# Altium project Custom Arduino Nano Control board.PrjPcb
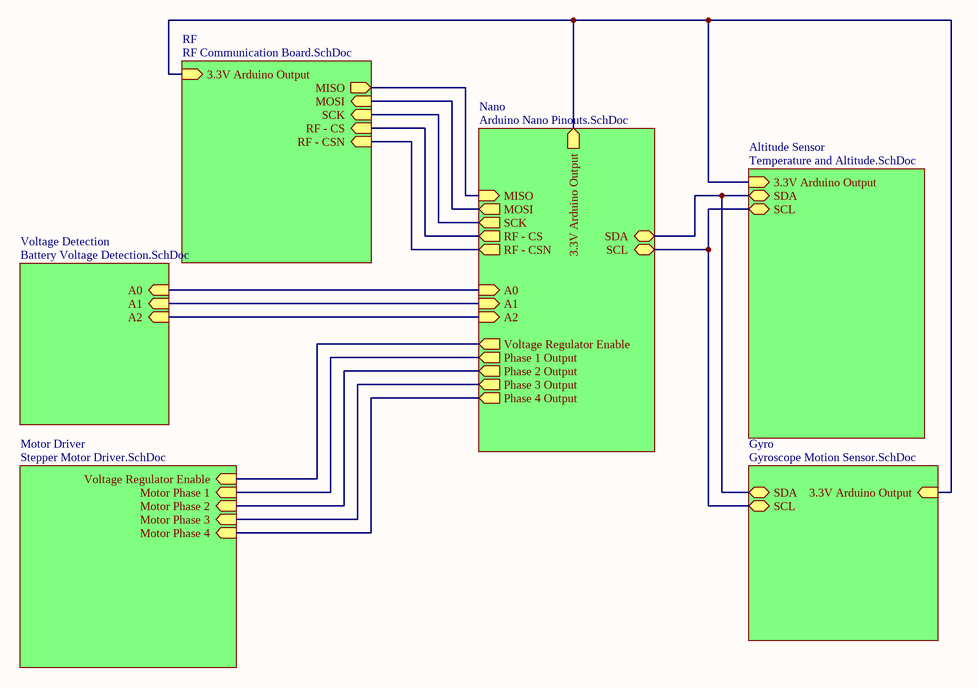
[diagram p0: Master Schematic.SchDoc]
7 sheets, 64 parts. Net scope: hierarchical (ports join the sheet entries above them; power ports are global).
Board file: M.I.C. Control Board.PcbDoc
Sheets:
  Master Schematic.SchDoc
    Nano = Arduino Nano Pinouts.SchDoc
    Gyro = Gyroscope Motion Sensor.SchDoc
    RF = RF Communication Board.SchDoc
    Voltage Detection = Battery Voltage Detection.SchDoc
    Altitude Sensor = Temperature and Altitude.SchDoc
    Motor Driver = Stepper Motor Driver.SchDoc

## Sheet Master Schematic.SchDoc
size A

### Sub-sheets
Altitude Sensor = Temperature and Altitude.SchDoc: 3.3V Arduino Output (in), SDA (bidir), SCL (bidir)
Gyro = Gyroscope Motion Sensor.SchDoc: 3.3V Arduino Output (in), SDA (bidir), SCL (bidir)
Motor Driver = Stepper Motor Driver.SchDoc: Voltage Regulator Enable (in), Motor Phase 1 (in), Motor Phase 2 (in), Motor Phase 3 (in), Motor Phase 4 (in)
Nano = Arduino Nano Pinouts.SchDoc: MISO (in), MOSI (out), SCK (out), RF - CS (out), 3.3V Arduino Output (out), A0 (in), A1 (in), A2 (in), SDA (bidir), SCL (bidir), Phase 1 Output (out), Voltage Regulator Enable (out), Phase 2 Output (out), Phase 3 Output (out), Phase 4 Output (out), RF - CSN (out)
RF = RF Communication Board.SchDoc: MISO (out), SCK (in), MOSI (in), 3.3V Arduino Output (in), RF - CS (in), RF - CSN (in)
Voltage Detection = Battery Voltage Detection.SchDoc: A0 (in), A1 (in), A2 (in)

### Nets
NetA1_2: sheet Nano/3.3V Arduino Output, sheet Gyro/3.3V Arduino Output, sheet RF/3.3V Arduino Output, sheet Altitude Sensor/3.3V Arduino Output
NetA1_3: sheet Nano/SDA, sheet Gyro/SDA, sheet Altitude Sensor/SDA
NetA1_4: sheet Nano/SCL, sheet Gyro/SCL, sheet Altitude Sensor/SCL
NetBatt1_3: sheet Nano/A0, sheet Voltage Detection/A0
NetDriver1_1: sheet Nano/Phase 1 Output, sheet Motor Driver/Motor Phase 1
NetDriver1_2: sheet Nano/Phase 2 Output, sheet Motor Driver/Motor Phase 2
NetDriver1_3: sheet Nano/Phase 3 Output, sheet Motor Driver/Motor Phase 3
NetDriver1_4: sheet Nano/Phase 4 Output, sheet Motor Driver/Motor Phase 4
NetNano1_10: sheet Nano/Voltage Regulator Enable, sheet Motor Driver/Voltage Regulator Enable
NetNano1_11: sheet Nano/RF - CSN, sheet RF/RF - CSN
NetNano1_13: sheet Nano/RF - CS, sheet RF/RF - CS
NetNano1_14: sheet Nano/MOSI, sheet RF/MOSI
NetNano1_15: sheet Nano/MISO, sheet RF/MISO
NetNano1_25: sheet Nano/A2, sheet Voltage Detection/A2
NetNano1_26: sheet Nano/A1, sheet Voltage Detection/A1
NetNano1_30: sheet Nano/SCK, sheet RF/SCK

## Sheet Arduino Nano Pinouts.SchDoc
size A
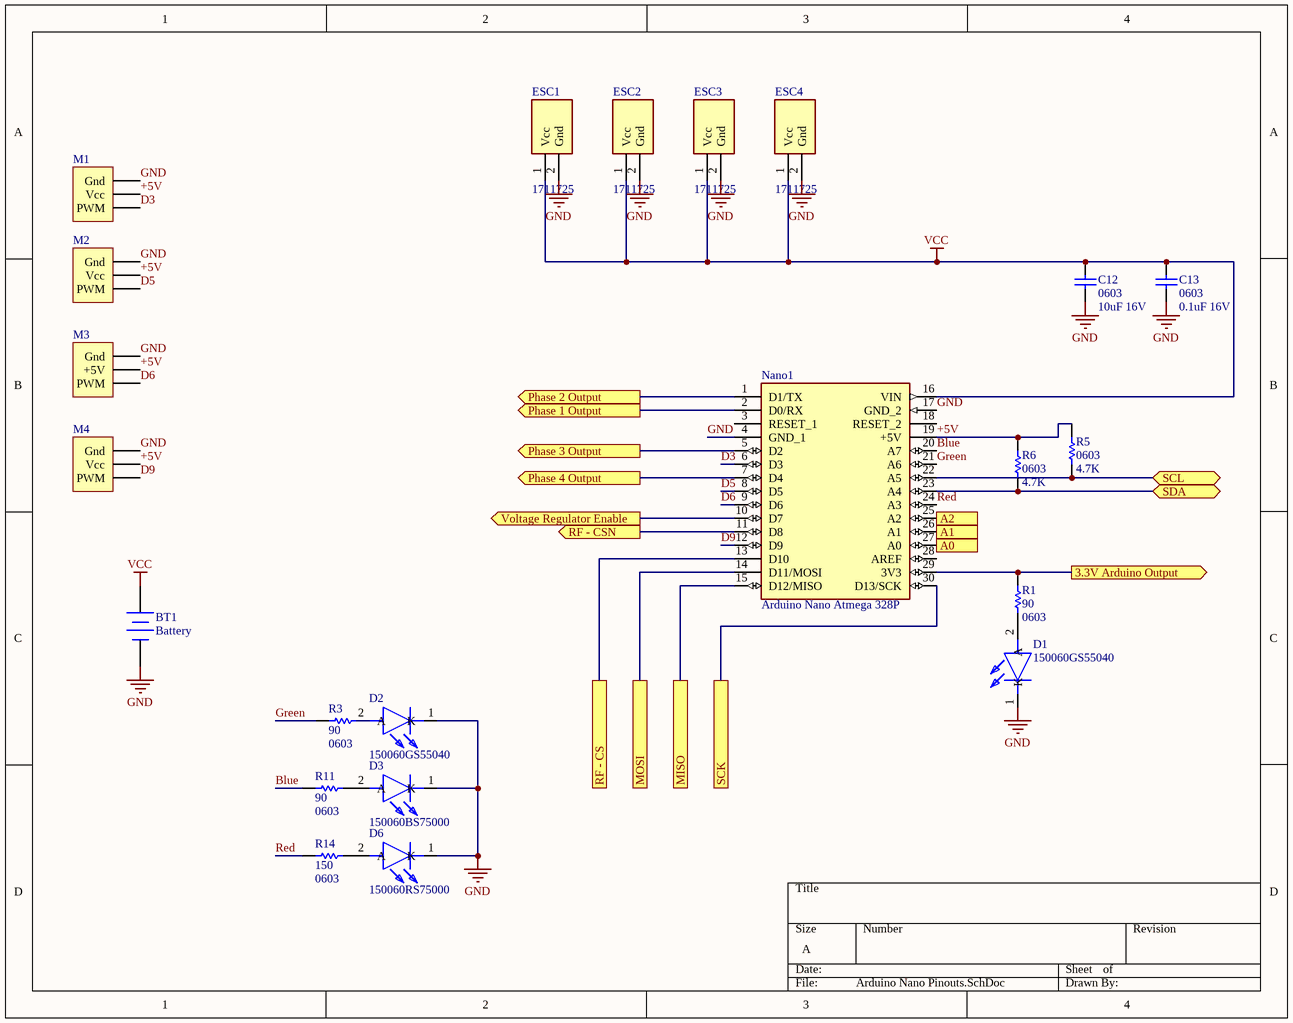
[diagram p1: Arduino Nano Pinouts.SchDoc]

### Parts
BT1  Battery  [12AWGBATTCONNECTOR]
C12  0603  value 10uF 16V  [SMD-0603C]
C13  0603  value 0.1uF 16V  [SMD-0603C]
D1  150060GS55040  [LEDC1608X50N]
D2  150060GS55040  [LEDC1608X50N]
D3  150060BS75000  [LEDC1608X80N]
D6  150060RS75000  [LEDC1608X80N]
ESC1  1711725  [PHEONIX-5.08PITCH-2PIN]
ESC2  1711725  [PHEONIX-5.08PITCH-2PIN]
ESC3  1711725  [PHEONIX-5.08PITCH-2PIN]
ESC4  1711725  [PHEONIX-5.08PITCH-2PIN]
M1  (no value)  [*TE_3-644695-3]
M2  (no value)  [*TE_3-644695-3]
M3  (no value)  [*TE_3-644695-3]
M4  (no value)  [*TE_3-644695-3]
Nano1  Arduino Nano Atmega 328P  [ARDNanoINV]
R1  90  value 0603  [SMD-0603-RES]
R3  90  value 0603  [SMD-0603-RES]
R5  0603  value 4.7K  [SMD-0603C]
R6  0603  value 4.7K  [SMD-0603-RES]
R11  90  value 0603  [SMD-0603-RES]
R14  150  value 0603  [SMD-0603-RES]

### Ports
3.3V Arduino Output (out), A0 (in), A1 (in), A2 (in), MISO, MOSI, Phase 1 Output (out), Phase 2 Output (out), Phase 3 Output (out), Phase 4 Output (out), RF - CS, RF - CSN (out), SCK, SCL (bidir), SDA (bidir), Voltage Regulator Enable (out)

### Nets
GND: BT1.2(-) C12.1 C13.1 D1.1(K) D2.1(K) D3.1(K) D6.1(K) ESC1.2(Gnd) ESC2.2(Gnd) ESC3.2(Gnd) ESC4.2(Gnd) M1.3(Gnd) M2.3(Gnd) M3.3(Gnd) M4.3(Gnd) Nano1.4(GND_1) Nano1.17(GND_2)
VCC: BT1.1(+) C12.2 C13.2 ESC1.1(Vcc) ESC2.1(Vcc) ESC3.1(Vcc) ESC4.1(Vcc) Nano1.16(VIN)
+5V: M1.2(Vcc) M2.2(Vcc) M3.2(+5V) M4.2(Vcc) Nano1.19(+5V) R5.2 R6.2
Blue: Nano1.20(A7) R11.1
D3: M1.1(PWM) Nano1.6(D3)
D5: M2.1(PWM) Nano1.8(D5)
D6: M3.1(PWM) Nano1.9(D6)
D9: M4.1(PWM) Nano1.12(D9)
Green: Nano1.21(A6) R3.1
Red: Nano1.24(A3) R14.1
NetA1_2: Nano1.29(3V3) R1.1 ; port 3.3V Arduino Output
NetA1_3: Nano1.23(A4) R6.1 ; port SDA
NetA1_4: Nano1.22(A5) R5.1 ; port SCL
NetBatt1_3: Nano1.27(A0) ; port A0
NetD1_2: D1.2(A) R1.2
NetD2_2: D2.2(A) R3.2
NetD3_2: D3.2(A) R11.2
NetD6_2: D6.2(A) R14.2
NetDriver1_1: Nano1.2(D0/RX) ; port Phase 1 Output
NetDriver1_2: Nano1.1(D1/TX) ; port Phase 2 Output
NetDriver1_3: Nano1.5(D2) ; port Phase 3 Output
NetDriver1_4: Nano1.7(D4) ; port Phase 4 Output
NetNano1_10: Nano1.10(D7) ; port Voltage Regulator Enable
NetNano1_11: Nano1.11(D8) ; port RF - CSN
NetNano1_13: Nano1.13(D10) ; port RF - CS
NetNano1_14: Nano1.14(D11/MOSI) ; port MOSI
NetNano1_15: Nano1.15(D12/MISO) ; port MISO
NetNano1_25: Nano1.25(A2) ; port A2
NetNano1_26: Nano1.26(A1) ; port A1
NetNano1_30: Nano1.30(D13/SCK) ; port SCK

Not connected (* = marked no-connect by the designer): Nano1 3(RESET_1) 18(RESET_2) 28(AREF)

### Library data of the parts
BT1 = Battery: Multicell Battery; Published: 24-Mar-1999; LatestRevisionDate: 17-Jul-2002; LatestRevisionNote: Re-released for DXP Platform.; PackageReference: BAT-2; Publisher: Altium Limited; PackageDescription: Battery; 2 Leads
C12 C13 = Cap: Capacitor; Published: 8-Jun-2000; LatestRevisionDate: 17-Jul-2002; LatestRevisionNote: Re-released for DXP Platform.; PackageReference: RAD-0.3; Publisher: Altium Limited; PackageDescription: Radial Cap, Thru-Hole; 2 Leads; 0.3 in Pin Spacing
D1 D2 = 150060GS55040: LED; Manufacturer_Name: Wurth Elektronik; Datasheet Link: https://katalog.we-online.de/led/datasheet/150060GS55040.pdf; Height: 0.5mm; Manufacturer_Part_Number: 150060GS55040; Mouser Part Number: 710-150060GS55040; Mouser Price/Stock: https://www.mouser.com/Search/Refine.aspx?Keyword=710-150060GS55040; RS Part Number: 1766068P; RS Price/Stock: http://uk.rs-online.com/web/p/products/1766068P
D3 = 150060BS75000: LED; Manufacturer_Name: Wurth Elektronik; Datasheet Link: https://componentsearchengine.com/Datasheets/2/150060BS75000.pdf; Height: 0.8mm; Manufacturer_Part_Number: 150060BS75000; Mouser Part Number: 710-150060BS75000; Mouser Price/Stock: https://www.mouser.com/Search/Refine.aspx?Keyword=710-150060BS75000; RS Part Number: 8154206P; RS Price/Stock: http://uk.rs-online.com/web/p/products/8154206P
D6 = 150060RS75000: LED; Manufacturer_Name: Wurth Elektronik; Datasheet Link: http://katalog.we-online.de/led/datasheet/150060RS75000.pdf; Height: 0.8mm; Manufacturer_Part_Number: 150060RS75000; Mouser Part Number: 710-150060RS75000; Mouser Price/Stock: https://www.mouser.com/Search/Refine.aspx?Keyword=710-150060RS75000; RS Part Number: 8154203P; RS Price/Stock: http://uk.rs-online.com/web/p/products/8154203P
ESC1-ESC4 = 1711725: Integrated Circuit; Manufacturer_Name: Phoenix Contact; Allied_Number: 70054425; Datasheet Link: http://docs-asia.electrocomponents.com/webdocs/1380/0900766b81380186.pdf; Manufacturer_Part_Number: 1711725; Mouser Part Number: 651-1711725; Mouser Price/Stock: https://www.mouser.com/Search/Refine.aspx?Keyword=651-1711725; RS Part Number: 1895843; RS Price/Stock: http://uk.rs-online.com/web/p/products/1895843; Allied Price/Stock: http://www.alliedelec.com/phoenix-contact-1711725/70054425/
M1-M4 = Header 3: Header, 3-Pin; LatestRevisionDate: 17-Jul-2002; LatestRevisionNote: Re-released for DXP Platform.; Publisher: Altium Limited
Nano1 = ARDNanoINV: Integrated Circuit; Datasheet Link: https://componentsearchengine.com/Datasheets/2/A000005.pdf; Height: 10.1mm; Manufacturer_Name: Arduino; Manufacturer_Part_Number: ARDNanoINV; Mouser Part Number: 992-ARD-NANO30; Mouser Price/Stock: http://www.mouser.com/Search/ProductDetail.aspx?qs=Vxac6xGyzPmCaTfvE003gg%3d%3d
R1 R3 R5 R6 R11 R14 = Res1: Resistor; Published: 8-Jun-2000; LatestRevisionDate: 17-Jul-2002; LatestRevisionNote: Re-released for DXP Platform.; PackageReference: AXIAL-0.3; Publisher: Altium Limited; PackageDescription: Axial Device, Thru-Hole; 2 Leads; 0.3 in Pin Spacing

## Sheet Gyroscope Motion Sensor.SchDoc
size A
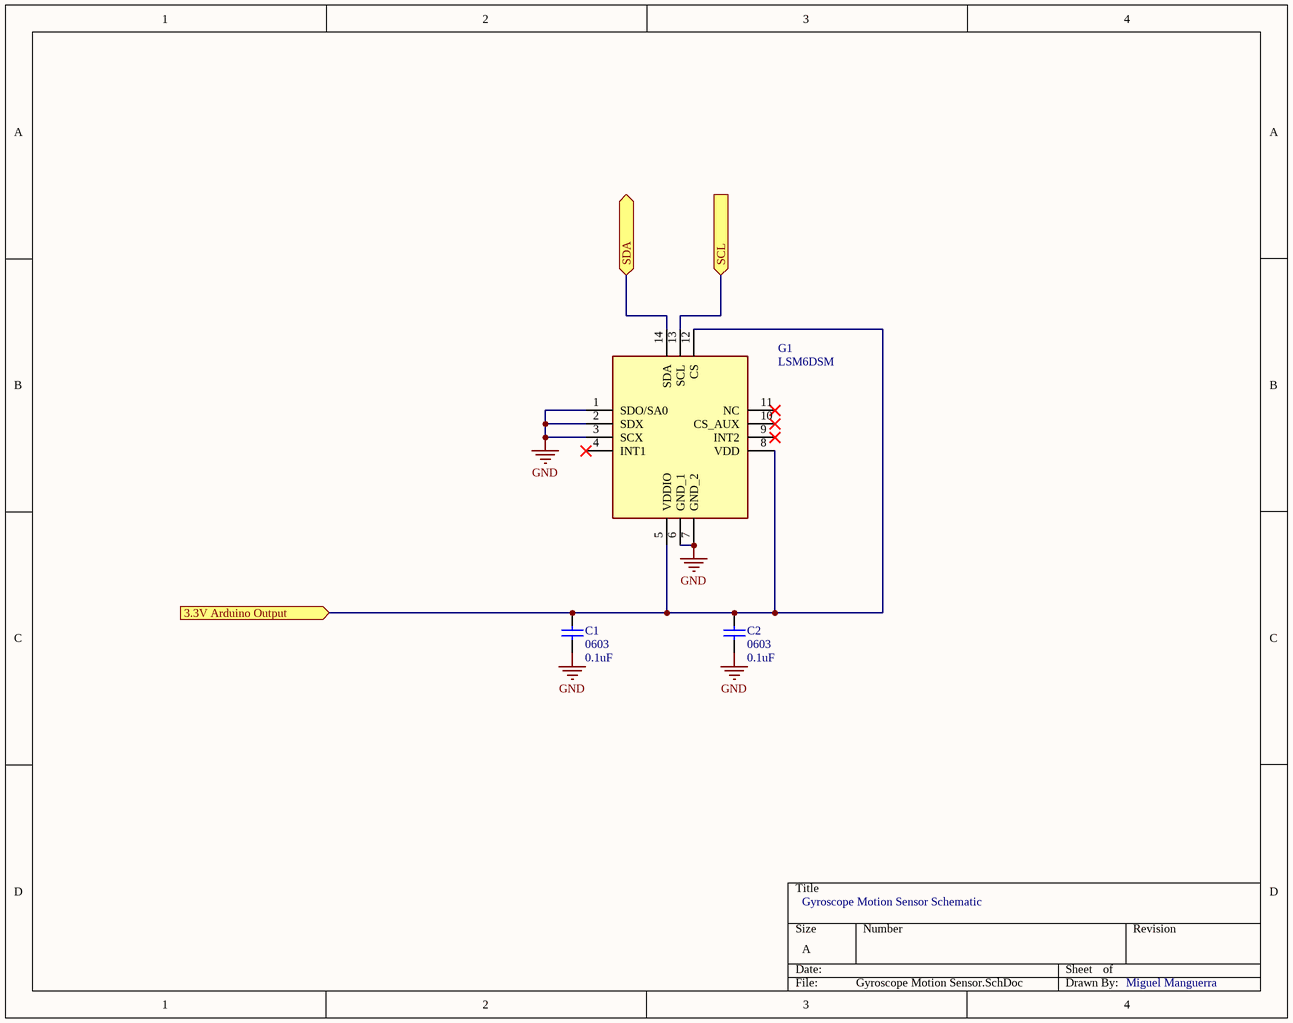
[diagram p2: Gyroscope Motion Sensor.SchDoc]

### Parts
C1  0603  value 0.1uF  [SMD-0603C]
C2  0603  value 0.1uF  [SMD-0603C]
G1  LSM6DSM  [LGA-14(2.5X3X0.86)]

### Ports
3.3V Arduino Output (in), SCL (in), SDA (bidir)

### Nets
GND: C1.1 C2.1 G1.1(SDO/SA0) G1.2(SDX) G1.3(SCX) G1.6(GND_1) G1.7(GND_2)
NetA1_2: C1.2 C2.2 G1.5(VDDIO) G1.8(VDD) G1.12(CS) ; port 3.3V Arduino Output
NetA1_3: G1.14(SDA) ; port SDA
NetA1_4: G1.13(SCL) ; port SCL

Not connected (* = marked no-connect by the designer): G1 4(INT1)* 9(INT2)* 10(CS_AUX)* 11(NC)*

### Notes on the sheet
- Gyroscope Motion Sensor Schematic
- Miguel Manguerra

### Library data of the parts
C1 C2 = Cap: Capacitor; Published: 8-Jun-2000; LatestRevisionDate: 17-Jul-2002; LatestRevisionNote: Re-released for DXP Platform.; PackageReference: RAD-0.3; Publisher: Altium Limited; PackageDescription: Radial Cap, Thru-Hole; 2 Leads; 0.3 in Pin Spacing
G1 = LSM6DS3HTR: Integrated Circuit; Manufacturer_Name: STMicroelectronics; Datasheet Link: http://www.st.com/content/ccc/resource/technical/document/datasheet/group0/38/96/79/af/ab/62/42/c3/DM00229854/files/DM00229854.pdf/jcr:content/translations/en.DM00229854.pdf; Manufacturer_Part_Number: LSM6DS3HTR; Mouser Part Number: 511-LSM6DS3HTR; Mouser Price/Stock: https://www.mouser.com/Search/Refine.aspx?Keyword=511-LSM6DS3HTR

## Sheet RF Communication Board.SchDoc
size A
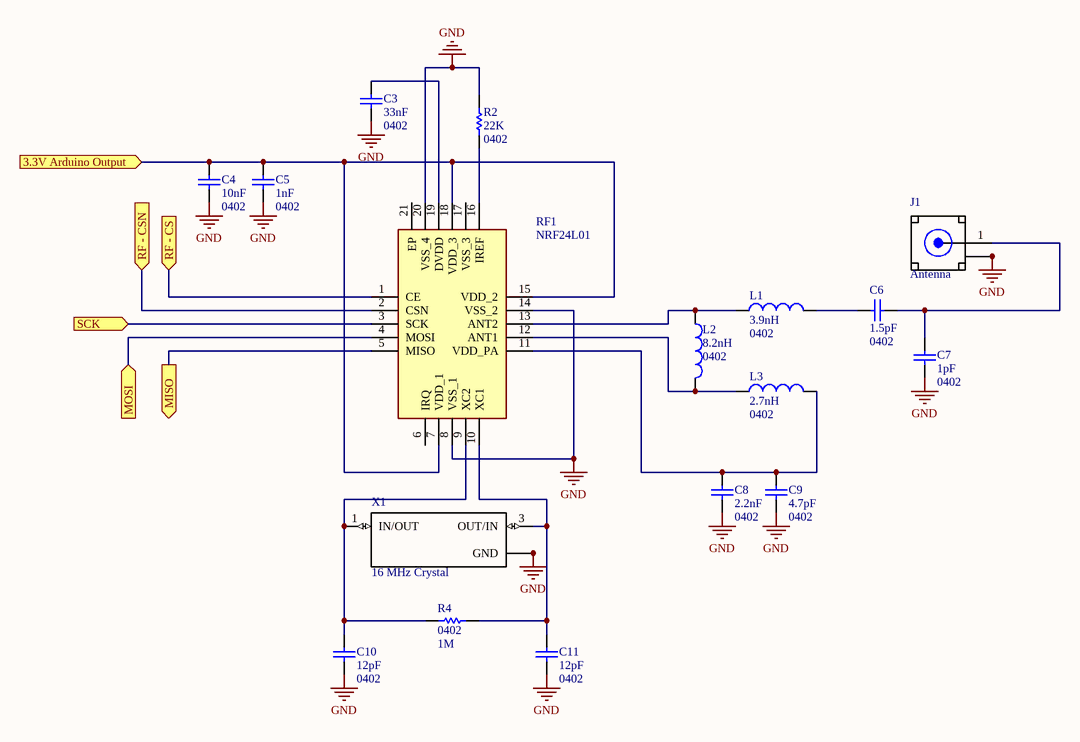
[diagram p3: RF Communication Board.SchDoc]

### Parts
C3  33nF  value 0402  [SMD-0402C]
C4  10nF  value 0402  [SMD-0402C]
C5  1nF  value 0402  [SMD-0402C]
C6  1.5pF  value 0402  [SMD-0402C]
C7  1pF  value 0402  [SMD-0402C]
C8  2.2nF  value 0402  [SMD-0402C]
C9  4.7pF  value 0402  [SMD-0402C]
C10  12pF  value 0402  [SMD-0402C]
C11  12pF  value 0402  [SMD-0402C]
J1  Antenna  [*SAMTEC_SMA-J-P-H-RA-TH1]
L1  3.9nH  value 0402  [0402-A]
L2  8.2nH  value 0402  [0402-A]
L3  2.7nH  value 0402  [0402-A]
R2  22K  value 0402  [SMD-0402-RES]
R4  0402  value 1M  [SMD-0402-RES]
RF1  NRF24L01  [QFN50P400X400X95-21N-D]
X1  16 MHz Crystal  [*XTAL_ECS-160-12-30BQ-AEN-TR]

### Ports
3.3V Arduino Output (in), MISO (out), MOSI (in), RF - CS (in), RF - CSN (in), SCK (in)

### Nets
GND: C3.1 C4.1 C5.1 C7.1 C8.1 C9.1 C10.1 C11.1 J1.2(GND) J1.3(GND) J1.4(GND) J1.5(GND) R2.2 RF1.8(VSS_1) RF1.14(VSS_2) RF1.20(VSS_4) X1.2(GND) X1.4(GND)
NetA1_2: C4.2 C5.2 RF1.7(VDD_1) RF1.15(VDD_2) RF1.18(VDD_3) ; port 3.3V Arduino Output
NetC3_2: C3.2 RF1.19(DVDD)
NetC6_1: C6.1 L1.2
NetC6_2: C6.2 C7.2 J1.1(SIGNAL)
NetC8_2: C8.2 C9.2 L3.2 RF1.11(VDD_PA)
NetC10_2: C10.2 R4.2 RF1.9(XC2) X1.1(IN/OUT)
NetC11_2: C11.2 R4.1 RF1.10(XC1) X1.3(OUT/IN)
NetL1_1: L1.1 L2.1 RF1.13(ANT2)
NetL2_2: L2.2 L3.1 RF1.12(ANT1)
NetNano1_11: RF1.2(CSN) ; port RF - CSN
NetNano1_13: RF1.1(CE) ; port RF - CS
NetNano1_14: RF1.4(MOSI) ; port MOSI
NetNano1_15: RF1.5(MISO) ; port MISO
NetNano1_30: RF1.3(SCK) ; port SCK
NetR2_1: R2.1 RF1.16(IREF)

Not connected (* = marked no-connect by the designer): RF1 6(IRQ) 17(VSS_3) 21(EP)

### Library data of the parts
C3-C11 = Cap: Capacitor; Published: 8-Jun-2000; LatestRevisionDate: 17-Jul-2002; LatestRevisionNote: Re-released for DXP Platform.; PackageReference: RAD-0.3; Publisher: Altium Limited; PackageDescription: Radial Cap, Thru-Hole; 2 Leads; 0.3 in Pin Spacing
J1 = SMA-J-P-H-RA-TH1: SMA Connector Jack, Female Socket 50Ohm Through Hole, Right Angle Solder; MF: Samtec; SnapEDA_Link: https://www.snapeda.com/parts/SMA-J-P-H-RA-TH1/Samtec%20Inc./view-part/134498/?ref=snap; Availability: Unavailable; MP: SMA-J-P-H-RA-TH1; Price: None; Package: None; Value: *
L1-L3 = Inductor: Code_IEC: 1005; Published: 8-Jun-2000; LatestRevisionDate: 29-May-2009; LatestRevisionNote: IPC-7351 Footprint Added.; PackageReference: 0402-A; Publisher: Altium Limited; PackageDescription: Chip Inductor; Code_JEITA: 0402
R2 R4 = Res1: Resistor; Published: 8-Jun-2000; LatestRevisionDate: 17-Jul-2002; LatestRevisionNote: Re-released for DXP Platform.; PackageReference: AXIAL-0.3; Publisher: Altium Limited; PackageDescription: Axial Device, Thru-Hole; 2 Leads; 0.3 in Pin Spacing
RF1 = NRF24L01: Integrated Circuit; Manufacturer_Name: Nordic Semiconductor; Datasheet Link: https://www.nordicsemi.com/chi/content/download/2730/34105/file/nRF24L01_Product_Specification_v2_0.pdf; Height: 0.95mm; Manufacturer_Part_Number: NRF24L01; Mouser Part Number: 949-NRF24L01; Mouser Price/Stock: https://www.mouser.com/Search/Refine.aspx?Keyword=949-NRF24L01; RS Part Number: 6156531; RS Price/Stock: http://uk.rs-online.com/web/p/products/6156531
X1 = ECS-160-12-30BQ-AEN-TR: / 16MHz Â±25ppm Crystal 12pF 50 Ohms 4-SMD, No Lead /; MF: ECS Inc.; Availability: Unavailable; SnapEDA_Link: https://www.snapeda.com/parts/ECS-160-12-30BQ-AEN-TR/ECS%20Inc./view-part/2749540/?ref=snap; MP: ECS-160-12-30BQ-AEN-TR; Price: None; Package: SMD-4 ECS International; Value: *

## Sheet Battery Voltage Detection.SchDoc
size A
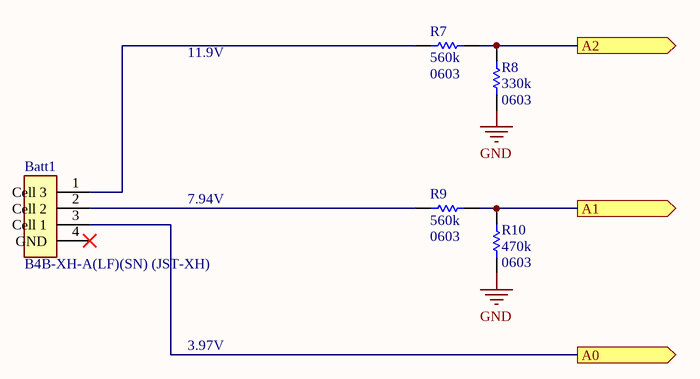
[diagram p4: Battery Voltage Detection.SchDoc]

### Parts
Batt1  B4B-XH-A(LF)(SN) (JST-XH)  [JST_B4B-XH-A(LF)(SN)]
R7  560k  value 0603  [SMD-0603-RES]
R8  330k  value 0603  [SMD-0603-RES]
R9  560k  value 0603  [SMD-0603-RES]
R10  470k  value 0603  [SMD-0603-RES]

### Ports
A0 (out), A1 (out), A2 (out)

### Nets
GND: R8.1 R10.1
NetBatt1_1: Batt1.1(Cell_3) R7.2
NetBatt1_2: Batt1.2(Cell_2) R9.2
NetBatt1_3: Batt1.3(Cell_1) ; port A0
NetNano1_25: R7.1 R8.2 ; port A2
NetNano1_26: R9.1 R10.2 ; port A1

Not connected (* = marked no-connect by the designer): Batt1 4(GND)*

### Notes on the sheet
- 11.9V
- 7.94V
- 3.97V

### Library data of the parts
Batt1 = B4B-XH-A(LF)(SN): Connector Header Through Hole 4 position 0.098 _2.50mm_; MP: B4B-XH-A_LF__SN_; MF: JST Sales; Price: None; Package: None; Value: *; Availability: Unavailable; SnapEDA_Link: https://www.snapeda.com/parts/B4B-XH-A%28LF%29%28SN%29/JST%20Sales%20America%20Inc./view-part/447494/?ref=snap
R7-R10 = Res1: Resistor; Published: 8-Jun-2000; LatestRevisionDate: 17-Jul-2002; LatestRevisionNote: Re-released for DXP Platform.; PackageReference: AXIAL-0.3; Publisher: Altium Limited; PackageDescription: Axial Device, Thru-Hole; 2 Leads; 0.3 in Pin Spacing

## Sheet Temperature and Altitude.SchDoc
size A4
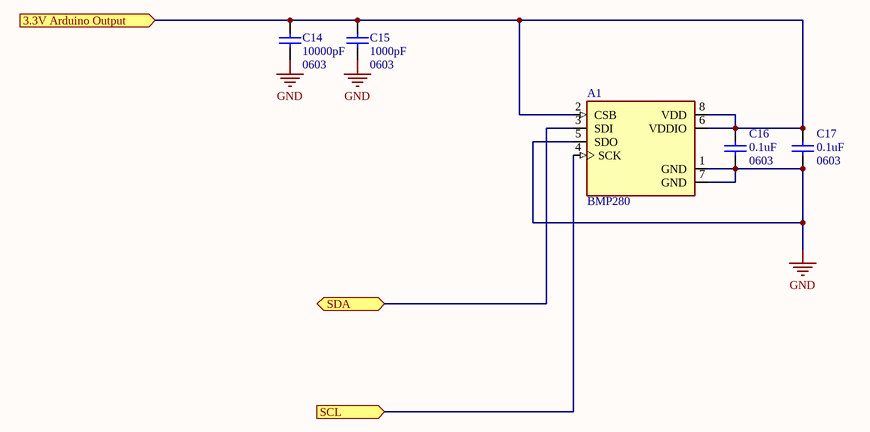
[diagram p5: Temperature and Altitude.SchDoc]

### Parts
A1  BMP280  [8-PIN-METAL-LID-LGA]
C14  10000pF  value 0603  [SMD-0603C]
C15  1000pF  value 0603  [SMD-0603C]
C16  0603  value 0.1uF  [SMD-0603C]
C17  0603  value 0.1uF  [SMD-0603C]

### Ports
3.3V Arduino Output (in), SCL (in), SDA (bidir)

### Nets
GND: A1.1(GND) A1.5(SDO) A1.7(GND) C14.1 C15.1 C16.1 C17.1
NetA1_2: A1.2(CSB) A1.6(VDDIO) A1.8(VDD) C14.2 C15.2 C16.2 C17.2 ; port 3.3V Arduino Output
NetA1_3: A1.3(SDI) ; port SDA
NetA1_4: A1.4(SCK) ; port SCL

### Library data of the parts
A1 = BMP280: Pressure Sensor 4.35PSI ~ 15.95PSI _30kPa ~ 110kPa_ Absolute 16b 8-SMD; MF: Bosch; SnapEDA_Link: https://www.snapeda.com/parts/BMP280/Bosch%20Sensortec/view-part/1186631/?ref=snap; Package: SMD-8 Bosch Sensortec; MP: BMP280; Value: *; Digi-Key_Part_Number: 828-1064-1-ND; Digi-Key_Purchase_URL: https://www.digikey.com/product-detail/en/bosch-sensortec/BMP280/828-1064-1-ND/6136315?utm_source=snapeda&utm_medium=aggregator&utm_campaign=symbol
C14-C17 = Cap: Capacitor; Published: 8-Jun-2000; LatestRevisionDate: 17-Jul-2002; LatestRevisionNote: Re-released for DXP Platform.; PackageReference: RAD-0.3; Publisher: Altium Limited; PackageDescription: Radial Cap, Thru-Hole; 2 Leads; 0.3 in Pin Spacing

## Sheet Stepper Motor Driver.SchDoc
size A
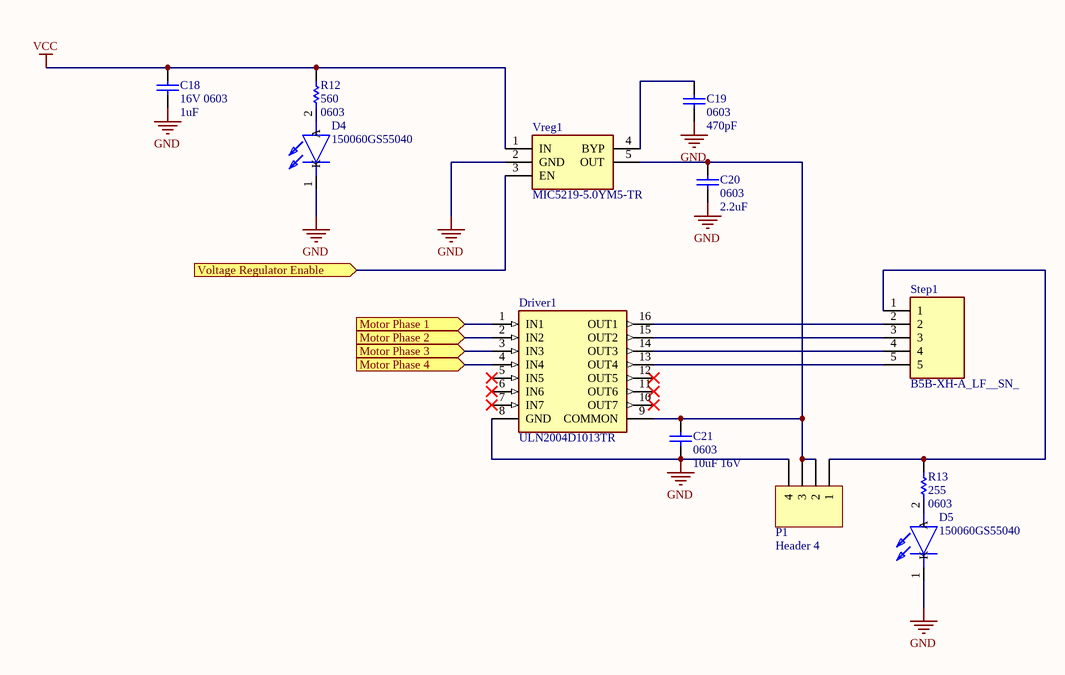
[diagram p6: Stepper Motor Driver.SchDoc]

### Parts
C18  16V 0603  value 1uF  [SMD-0603C]
C19  0603  value 470pF  [SMD-0603C]
C20  0603  value 2.2uF  [SMD-0603C]
C21  0603  value 10uF 16V  [SMD-0603C]
D4  150060GS55040  [LEDC1608X50N]
D5  150060GS55040  [LEDC1608X50N]
Driver1  ULN2004D1013TR  [SOIC127P600X175-16N]
P1  Header 4  [HDR1X4]
R12  560  value 0603  [SMD-0603-RES]
R13  255  value 0603  [SMD-0603-RES]
Step1  B5B-XH-A_LF__SN_  [SHDR5W64P0X250_1X5_1490X575X700P]
Vreg1  MIC5219-5.0YM5-TR  [SOT95P280X145-5N]

### Ports
Motor Phase 1 (in), Motor Phase 2 (in), Motor Phase 3 (in), Motor Phase 4 (in), Voltage Regulator Enable (in)

### Nets
GND: C18.1 C19.1 C20.1 C21.1 D4.1(K) D5.1(K) Driver1.8(GND) P1.4 Vreg1.2(GND)
VCC: C18.2 R12.1 Vreg1.1(IN)
NetC19_2: C19.2 Vreg1.4(BYP)
NetC20_2: C20.2 C21.2 Driver1.9(COMMON) P1.2 P1.3 Vreg1.5(OUT)
NetD4_2: D4.2(A) R12.2
NetD5_2: D5.2(A) R13.2
NetDriver1_1: Driver1.1(IN1) ; port Motor Phase 1
NetDriver1_2: Driver1.2(IN2) ; port Motor Phase 2
NetDriver1_3: Driver1.3(IN3) ; port Motor Phase 3
NetDriver1_4: Driver1.4(IN4) ; port Motor Phase 4
NetDriver1_13: Driver1.13(OUT4) Step1.5
NetDriver1_14: Driver1.14(OUT3) Step1.4
NetDriver1_15: Driver1.15(OUT2) Step1.3
NetDriver1_16: Driver1.16(OUT1) Step1.2
NetNano1_10: Vreg1.3(EN) ; port Voltage Regulator Enable
NetP1_1: P1.1 R13.1 Step1.1

Not connected (* = marked no-connect by the designer): Driver1 5(IN5)* 6(IN6)* 7(IN7)* 10(OUT7)* 11(OUT6)* 12(OUT5)*

### Library data of the parts
C18-C21 = Cap: Capacitor; Published: 8-Jun-2000; LatestRevisionDate: 17-Jul-2002; LatestRevisionNote: Re-released for DXP Platform.; PackageReference: RAD-0.3; Publisher: Altium Limited; PackageDescription: Radial Cap, Thru-Hole; 2 Leads; 0.3 in Pin Spacing
D4 D5 = 150060GS55040: LED; Manufacturer_Name: Wurth Elektronik; Datasheet Link: https://katalog.we-online.de/led/datasheet/150060GS55040.pdf; Height: 0.5mm; Manufacturer_Part_Number: 150060GS55040; Mouser Part Number: 710-150060GS55040; Mouser Price/Stock: https://www.mouser.com/Search/Refine.aspx?Keyword=710-150060GS55040; RS Part Number: 1766068P; RS Price/Stock: http://uk.rs-online.com/web/p/products/1766068P
Driver1 = ULN2004D1013TR: Integrated Circuit; Manufacturer_Name: STMicroelectronics; Allied_Number: 70391946; Datasheet Link: http://www.st.com/st-web-ui/static/active/en/resource/technical/document/datasheet/CD00001244.pdf; Height: 1.75mm; Manufacturer_Part_Number: ULN2004D1013TR; Mouser Part Number: 511-ULN2004D1013TR; Mouser Price/Stock: https://www.mouser.com/Search/Refine.aspx?Keyword=511-ULN2004D1013TR; RS Part Number: 6868161P; RS Price/Stock: http://uk.rs-online.com/web/p/products/6868161P; Allied Price/Stock: http://www.alliedelec.com/stmicroelectronics-uln2004d1013tr/70391946/
P1 = Header 4: Header, 4-Pin; LatestRevisionDate: 17-Jul-2002; LatestRevisionNote: Re-released for DXP Platform.; Publisher: Altium Limited
R12 R13 = Res1: Resistor; Published: 8-Jun-2000; LatestRevisionDate: 17-Jul-2002; LatestRevisionNote: Re-released for DXP Platform.; PackageReference: AXIAL-0.3; Publisher: Altium Limited; PackageDescription: Axial Device, Thru-Hole; 2 Leads; 0.3 in Pin Spacing
Step1 = B5B-XH-A_LF__SN_: 28BYJ-48 Stepper Motor; Manufacturer_Name: JST (JAPAN SOLDERLESS TERMINALS); Manufacturer_Part_Number: B5B-XH-A(LF)(SN); Datasheet Link: http://www.jst-mfg.com/product/pdf/eng/eXH.pdf; Height: 7mm; RS Part Number: 8201560P; RS Price/Stock: http://uk.rs-online.com/web/p/products/8201560P
Vreg1 = MIC5219-5.0YM5-TR: Integrated Circuit; Manufacturer_Name: Microchip; Datasheet Link: http://ww1.microchip.com/downloads/en/DeviceDoc/MIC5219-500mA-Peak-Output-LDO-Regulator-DS20006021A.pdf; Height: 1.45mm; Manufacturer_Part_Number: MIC5219-5.0YM5-TR; Mouser Part Number: 998-MIC5219-5.0YM5TR; Mouser Price/Stock: https://www.mouser.com/Search/Refine.aspx?Keyword=998-MIC5219-5.0YM5TR; RS Part Number: 9101755P; RS Price/Stock: http://uk.rs-online.com/web/p/products/9101755P

## Nets that join several sheets
GND: Arduino Nano Pinouts (17 pins), Gyroscope Motion Sensor (7 pins), RF Communication Board (18 pins), Battery Voltage Detection (R8.1 R10.1), Temperature and Altitude (7 pins), Stepper Motor Driver (9 pins)
VCC: Arduino Nano Pinouts (8 pins), Stepper Motor Driver (C18.2 R12.1 Vreg1.1)
NetA1_2: Arduino Nano Pinouts (Nano1.29 R1.1), Gyroscope Motion Sensor (5 pins), RF Communication Board (5 pins), Temperature and Altitude (7 pins)
NetA1_3: Arduino Nano Pinouts (Nano1.23 R6.1), Gyroscope Motion Sensor (G1.14), Temperature and Altitude (A1.3)
NetA1_4: Arduino Nano Pinouts (Nano1.22 R5.1), Gyroscope Motion Sensor (G1.13), Temperature and Altitude (A1.4)
NetBatt1_3: Arduino Nano Pinouts (Nano1.27), Battery Voltage Detection (Batt1.3)
NetDriver1_1: Arduino Nano Pinouts (Nano1.2), Stepper Motor Driver (Driver1.1)
NetDriver1_2: Arduino Nano Pinouts (Nano1.1), Stepper Motor Driver (Driver1.2)
NetDriver1_3: Arduino Nano Pinouts (Nano1.5), Stepper Motor Driver (Driver1.3)
NetDriver1_4: Arduino Nano Pinouts (Nano1.7), Stepper Motor Driver (Driver1.4)
NetNano1_10: Arduino Nano Pinouts (Nano1.10), Stepper Motor Driver (Vreg1.3)
NetNano1_11: Arduino Nano Pinouts (Nano1.11), RF Communication Board (RF1.2)
NetNano1_13: Arduino Nano Pinouts (Nano1.13), RF Communication Board (RF1.1)
NetNano1_14: Arduino Nano Pinouts (Nano1.14), RF Communication Board (RF1.4)
NetNano1_15: Arduino Nano Pinouts (Nano1.15), RF Communication Board (RF1.5)
NetNano1_25: Arduino Nano Pinouts (Nano1.25), Battery Voltage Detection (R7.1 R8.2)
NetNano1_26: Arduino Nano Pinouts (Nano1.26), Battery Voltage Detection (R9.1 R10.2)
NetNano1_30: Arduino Nano Pinouts (Nano1.30), RF Communication Board (RF1.3)